# Altium project PCB_Project1.PrjPCB
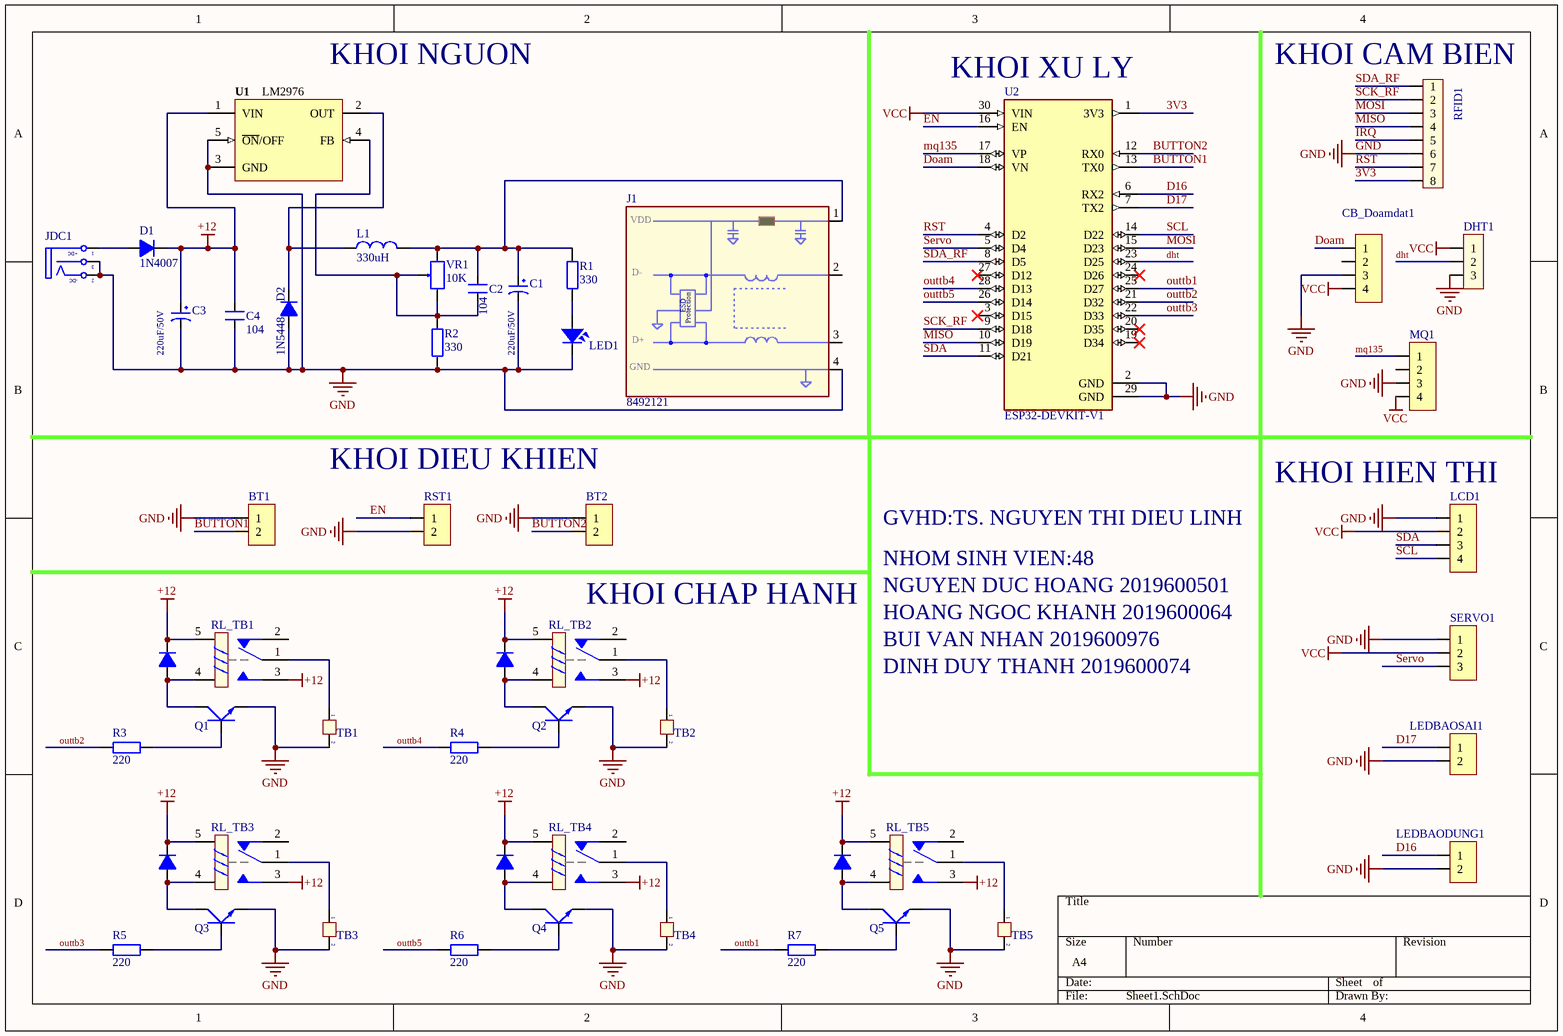
[diagram p0: Sheet1.SchDoc]
1 sheet, 51 parts. Net scope: global (net labels, ports and power ports of the same name join across sheets).
Board file: PCB1.PcbDoc

## Sheet Sheet1.SchDoc
size A4

### Parts
BT1  JP2  [JP2-C1T]  (value not drawn)
BT2  JP2  [JP2-C1T]  (value not drawn)
C1  220uF/50V  [CP1.5/3.4]
C2  104  [CN1]
C3  220uF/50V  [CP1.5/3.4]
C4  104  [CN1]
CB_Doamdat1  JP4  [JP4-C1T]  (value not drawn)
D1  1N4007  [D1A]
D2  1N5448  [D1A]
D3  1N4007  [D2A]  (value not drawn)
D4  1N4007  [D2A]  (value not drawn)
D5  1N4007  [D2A]  (value not drawn)
D6  1N4007  [D2A]  (value not drawn)
D7  1N4007  [D2A]  (value not drawn)
DHT1  Jumper 3  [JP3]  (value not drawn)
J1  8492121  [USB-C1]
JDC1  Jac DC  [DC-IN]  (value not drawn)
L1  330uH  [L01]
LCD1  JP4  [JP4-C1T]  (value not drawn)
LED1  LED  [LED-3]  (value not drawn)
LEDBAODUNG1  JP2  [JP2-C1T]  (value not drawn)
LEDBAOSAI1  JP2  [JP2-C1T]  (value not drawn)
MQ1  JP4  [JP4-C1T]  (value not drawn)
Q1  C1815  [QTO-92]  (value not drawn)
Q2  C1815  [QTO-92]  (value not drawn)
Q3  C1815  [QTO-92]  (value not drawn)
Q4  C1815  [QTO-92]  (value not drawn)
Q5  C1815  [QTO-92]  (value not drawn)
R1  330  [R1/2W]
R2  330  [R1/2W]
R3  220  [R1/2W]
R4  220  [R1/2W]
R5  220  [R1/2W]
R6  220  [R1/2W]
R7  220  [R1/2W]
RFID1  JP8 PIN  [JP8]  (value not drawn)
RL_TB1  Relay1  [RL_SPDT_10A]  (value not drawn)
RL_TB2  Relay1  [RL_SPDT_10A]  (value not drawn)
RL_TB3  Relay1  [RL_SPDT_10A]  (value not drawn)
RL_TB4  Relay1  [RL_SPDT_10A]  (value not drawn)
RL_TB5  Relay1  [RL_SPDT_10A]  (value not drawn)
RST1  JP2  [JP2-C1T]  (value not drawn)
SERVO1  JP3  [JP3-C1T]  (value not drawn)
TB1  Jumper 2  [JP2]  (value not drawn)
TB2  Jumper 2  [JP2]  (value not drawn)
TB3  Jumper 2  [JP2]  (value not drawn)
TB4  Jumper 2  [JP2]  (value not drawn)
TB5  Jumper 2  [JP2]  (value not drawn)
U1  LM2976  [DIP5-T]
U2  ESP32-DEVKIT-V1  [MODULE_ESP32_DEVKIT_V1]
VR1  10K  [VR]

### Nets
+12: C3.1 C4.2 D1.2(K) D3.2(K) D4.2(K) D5.2(K) D6.2(K) D7.2(K) RL_TB1.3 RL_TB1.5 RL_TB2.3 RL_TB2.5 RL_TB3.3 RL_TB3.5 RL_TB4.3 RL_TB4.5 RL_TB5.3 RL_TB5.5 U1.1(VIN)
GND: BT1.1 BT2.1 C1.2 C3.2 C4.1 CB_Doamdat1.3 D2.1(A) DHT1.3 J1.4(GND) JDC1.2(TN) JDC1.3(S) LCD1.1 LED1.2 LEDBAODUNG1.2 LEDBAOSAI1.2 MQ1.3 Q1.1(E) Q2.1(E) Q3.1(E) Q4.1(E) Q5.1(E) R2.1 RFID1.6 RST1.2 SERVO1.1 TB1.2 TB2.2 TB3.2 TB4.2 TB5.2 U1.3(GND) U1.5(~{ON}/OFF) U2.2(GND) U2.29(GND)
VCC: CB_Doamdat1.4 DHT1.1 LCD1.2 MQ1.4 SERVO1.2 U2.30(VIN)
3V3: RFID1.8 U2.1(3V3)
BUTTON1: BT1.2 U2.13(TX0)
BUTTON2: BT2.2 U2.12(RX0)
D16: LEDBAODUNG1.1 U2.6(RX2)
D17: LEDBAOSAI1.1 U2.7(TX2)
dht: DHT1.2 U2.23(D25)
Doam: CB_Doamdat1.1 U2.18(VN)
EN: RST1.1 U2.16(EN)
IRQ: RFID1.5
MISO: RFID1.4 U2.10(D19)
MOSI: RFID1.3 U2.15(D23)
mq135: MQ1.1 U2.17(VP)
outtb1: R7.1 U2.25(D27)
outtb2: R3.1 U2.21(D32)
outtb3: R5.1 U2.22(D33)
outtb4: R4.1 U2.28(D13)
outtb5: R6.1 U2.26(D14)
RST: RFID1.7 U2.4(D2)
SCK_RF: RFID1.2 U2.9(D18)
SCL: LCD1.4 U2.14(D22)
SDA: LCD1.3 U2.11(D21)
SDA_RF: RFID1.1 U2.8(D5)
Servo: SERVO1.3 U2.5(D4)
NetC1_1: C1.1 C2.2 J1.1(VBUS) L1.2 R1.2 VR1.3
NetC2_1: C2.1 R2.2 U1.4(FB) VR1.1 VR1.2
NetD1_1: D1.1(A) JDC1.1(T)
NetD2_2: D2.2(K) L1.1 U1.2(OUT)
NetD3_1: D3.1(A) Q1.2(C) RL_TB1.4
NetD4_1: D4.1(A) Q2.2(C) RL_TB2.4
NetD5_1: D5.1(A) Q3.2(C) RL_TB3.4
NetD6_1: D6.1(A) Q4.2(C) RL_TB4.4
NetD7_1: D7.1(A) Q5.2(C) RL_TB5.4
NetLED1_1: LED1.1 R1.1
NetQ1_3: Q1.3(B) R3.2
NetQ2_3: Q2.3(B) R4.2
NetQ3_3: Q3.3(B) R5.2
NetQ4_3: Q4.3(B) R6.2
NetQ5_3: Q5.3(B) R7.2
NetRL_TB1_1: RL_TB1.1 TB1.1
NetRL_TB2_1: RL_TB2.1 TB2.1
NetRL_TB3_1: RL_TB3.1 TB3.1
NetRL_TB4_1: RL_TB4.1 TB4.1
NetRL_TB5_1: RL_TB5.1 TB5.1

Not connected (* = marked no-connect by the designer): CB_Doamdat1 2; J1 2(D-) 3(D+); MQ1 2; RL_TB1 2; RL_TB2 2; RL_TB3 2; RL_TB4 2; RL_TB5 2; U2 3(D15)* 19(D34)* 20(D35)* 24(D26)* 27(D12)*

### Notes on the sheet
- (near U1) KHOI NGUON
- (near U2) KHOI XU LY
- (near RFID1) KHOI CAM BIEN
- KHOI DIEU KHIEN
- (near LCD1) KHOI HIEN THI
- GVHD:TS. NGUYEN THI DIEU LINH
- NHOM SINH VIEN:48
- (near RL_TB2) KHOI CHAP HANH
- NGUYEN DUC HOANG 2019600501
- HOANG NGOC KHANH 2019600064
- BUI VAN NHAN 2019600976
- DINH DUY THANH 2019600074
- (in symbol DCIN) +DC; -DC
- (in symbol USB-4) VDD; ESD; Protection

### Library data of the parts
BT1 BT2 LEDBAODUNG1 LEDBAOSAI1 RST1 = JP2: WR-PHD 2.54 mm Angled Socket Header; Manufacturer: Würth Elektronik eiSos GmbH; partNo: 613002143121; ComponentLink1 Description: Manufacturer; ComponentLink2 Description: Datasheet; NoPins: 02; Created Date: 29 March 2013; ComponentLink1URL: http://www.we-online.com; ComponentLink2URL: http://katalog.we-online.de/em/datasheet/6130xx143121.pdf; Created by: Karrer Zheng
C1 C3 = CP4: Cap 1000uF/16V - 220uF/50V; Description 5: 4,7uF>10uF/250V_3,3uF>10uF/400V - 2,2uF>4,7uF/450V; Description 1: 2200uF-3300uF/6,3V - 1000uF-2200uF/10V; Description 2: 1000uF/16V - 470uF => 1000uF/25V - 100uF/100V; Description 3: 330uF>470uF/35V_220uF>470uF/50V_10uF>22uF/250V; Description 4: 220uF => 330uF/63V - 10uF =>33uF/160 - 200V; Value: 1000uF/16V
C2 C4 = CN1: Cap np  1pF - 472pF; Value: 100pF
CB_Doamdat1 LCD1 MQ1 = JP4: WR-PHD 2.54 mm Angled Socket Header; Manufacturer: Würth Elektronik eiSos GmbH; partNo: 613004143121; ComponentLink1 Description: Manufacturer; ComponentLink2 Description: Datasheet; NoPins: 04; Created Date: 29 March 2013; ComponentLink1URL: http://www.we-online.com; ComponentLink2URL: http://katalog.we-online.de/em/datasheet/6130xx143121.pdf; Created by: Karrer Zheng
D1 D3-D7 = D1A: Diode 1A; Value: 1N4007
D2 = D1A: Diode 1A; Value: 1N4007
DHT1 = JP3: Value: J3
J1 = USB-4: THT USB 2.0 A Connector WE-EPLE; Manufacturer: Würth Elektronik eiSos GmbH; PartNo: 8492121; ComponentLink1Description: Manufacturer; ComponentLink1URL: http://www.we-online.de; Created by: Christin Otto; Created Date: OCT-2014; ComponentLink2Description: Datasheet; ComponentLink2URL: http://www.we-online.de/katalog/media/pdf/8492121.pdf
JDC1 = DCIN: Jac DC input; Value: Jac DC
L1 = L1: Inductor; Value: 150 mH
LED1 = LED: LED Single colour Green and Red; Value: LED 3 ly Single Colour
Q1-Q5 = C1815: NPN 600mW, ECB; Value: C1815
R1-R7 = R1/4W: Resistor 1/4W; Value: R1/4W - 1K
RFID1 = JP8: Value: JP7
RL_TB1-RL_TB5 = Relay 1: Relay SPDT,10A - 12VDC 5 Pin; Value: Relay SPDT, 10A, 12V
SERVO1 = JP3: WR-PHD 2.54 mm Angled Socket Header; Manufacturer: Würth Elektronik eiSos GmbH; partNo: 613003143121; ComponentLink1 Description: Manufacturer; ComponentLink2 Description: Datasheet; NoPins: 03; Created Date: 29 March 2013; ComponentLink1URL: http://www.we-online.com; ComponentLink2URL: http://katalog.we-online.de/em/datasheet/6130xx143121.pdf; Created by: Karrer Zheng
TB1-TB5 = JP 2: Value: JP 2
U1 = LM2596: Max Input Voltage: 12 V; Max Output Current: 3 (6.0 peak) A; Max Output Voltage: mV; Category: IC-Power; Min Input Voltage: mV; Min Output Voltage: mV; Mounting Technology: Surface Mount; Status: Unreleased; Supply Voltage: mV; Temperature Range: -40 to +125 degC
U2 = ESP32-DEVKIT-V1: Dual core, Wi-Fi: 2.4 GHz up to 150 Mbits/s,BLE (Bluetooth Low Energy) and legacy Bluetooth, 32 bits, Up to 240 MHz; MF: Do it; Price: None; Availability: Not in stock; Package: None; MP: ESP32-DEVKIT-V1; Value: *; SnapEDA_Link: https://www.snapeda.com/parts/ESP32-DEVKIT-V1/Do+it/view-part/?ref=snap; Check_prices: https://www.snapeda.com/parts/ESP32-DEVKIT-V1/Do+it/view-part/?ref=eda
VR1 = VR: Var Resistor; Value: VR 10K